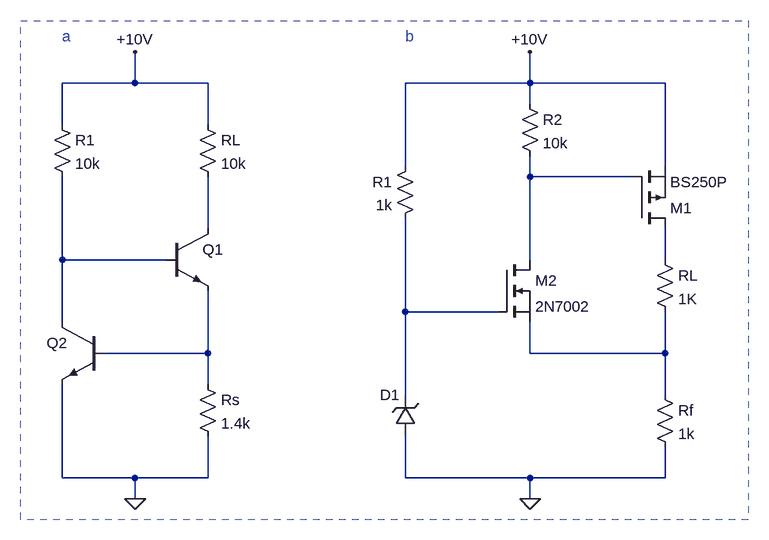
[diagram p0: schematic Ej 2.9.asc]
Ej 2.9.asc, the LTspice schematic file:
Version 4
SHEET 1 7772 18116
WIRE 3824 2928 3824 2880
WIRE 3824 2928 3712 2928
WIRE 3936 2928 3824 2928
WIRE 4432 2928 4432 2880
WIRE 4432 2928 4240 2928
WIRE 4640 2928 4432 2928
WIRE 4432 2960 4432 2928
WIRE 3712 2992 3712 2928
WIRE 3936 2992 3936 2928
WIRE 4240 3056 4240 2928
WIRE 4640 3056 4640 2928
WIRE 4432 3072 4432 3040
WIRE 4592 3072 4432 3072
WIRE 3936 3152 3936 3072
WIRE 3712 3200 3712 3072
WIRE 3872 3200 3712 3200
WIRE 4432 3200 4432 3072
WIRE 4640 3200 4640 3152
WIRE 4240 3280 4240 3136
WIRE 4384 3280 4240 3280
WIRE 3712 3296 3712 3200
WIRE 3936 3344 3936 3248
WIRE 3936 3344 3776 3344
WIRE 4432 3344 4432 3296
WIRE 4640 3344 4640 3280
WIRE 4640 3344 4432 3344
WIRE 3936 3392 3936 3344
WIRE 4240 3408 4240 3280
WIRE 4640 3408 4640 3344
WIRE 3712 3536 3712 3392
WIRE 3824 3536 3712 3536
WIRE 3936 3536 3936 3472
WIRE 3936 3536 3824 3536
WIRE 4240 3536 4240 3472
WIRE 4432 3536 4240 3536
WIRE 4640 3536 4640 3488
WIRE 4640 3536 4432 3536
WIRE 3824 3568 3824 3536
WIRE 4432 3568 4432 3536
FLAG 3824 2880 +10V
FLAG 3824 3568 0
FLAG 4432 2880 +10V
FLAG 4432 3568 0
SYMBOL npn 3872 3152 R0
WINDOW 3 56 68 Invisible 2
SYMATTR InstName Q1
SYMBOL npn 3776 3296 M0
WINDOW 3 56 68 Invisible 2
SYMATTR InstName Q2
SYMBOL res 3920 3376 R0
SYMATTR InstName Rs
SYMATTR Value 1.4k
SYMBOL res 3920 2976 R0
SYMATTR InstName RL
SYMATTR Value 10k
SYMBOL res 3696 2976 R0
SYMATTR InstName R1
SYMATTR Value 10k
SYMBOL nmos 4384 3200 R0
SYMATTR InstName M2
SYMATTR Value 2N7002
SYMBOL zener 4256 3472 R180
WINDOW 0 24 64 Left 2
WINDOW 3 24 0 Invisible 2
SYMATTR InstName D1
SYMBOL res 4256 3040 M0
SYMATTR InstName R1
SYMATTR Value 1k
SYMBOL res 4416 2944 R0
SYMATTR InstName R2
SYMATTR Value 10k
SYMBOL pmos 4592 3152 M180
SYMATTR InstName M1
SYMATTR Value BS250P
SYMBOL res 4624 3392 R0
SYMATTR InstName Rf
SYMATTR Value 1k
SYMBOL res 4624 3184 R0
SYMATTR InstName RL
SYMATTR Value 1K
TEXT 3712 2856 Left 2 ;a
TEXT 4240 2856 Left 2 ;b
RECTANGLE Normal 4768 3600 3648 2832 2

The netlist it stands for:
* Ej 2.9.asc
Q1 N002 N003 N006 0 NPN
Q2 N003 N006 0 0 NPN
Rs N006 0 1.4k
RL +10V N002 10k
R1 +10V N003 10k
M2 N001 N005 N007 N007 2N7002
D1 0 N005 D
R1 +10V N005 1k
R2 +10V N001 10k
M1 N004 N001 +10V +10V BS250P
Rf N007 0 1k
RL N004 N007 1K
.model D D
.lib standard.dio
.model NPN NPN
.model PNP PNP
.lib standard.bjt
.model NMOS NMOS
.model PMOS PMOS
.lib standard.mos
* a
* b
.backanno
.end